# EAGLE schematic power (EAGLE 7.5.0)
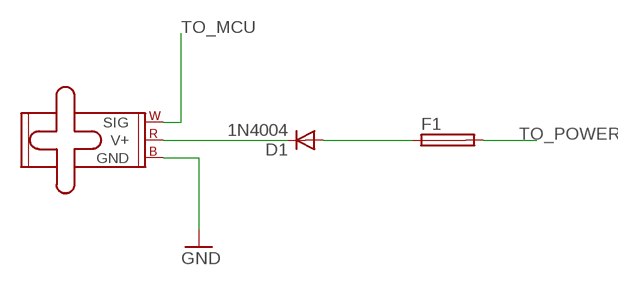
[diagram p0: schematic, sheet 1]

## Parts
D1  1N4004  [DO41-10]
F1  TE5  [TE5]
M1  SMALL_SERVO  [1X03]

## Nets
GND: M1.3(GND)
N$1: D1.C M1.2(V+)
N$2: D1.A F1.1
TO_MCU: M1.1(SIG)
TO_POWER: F1.2

## Library data of the parts
D1 = adafruit:1N4004: DIODE General purpose 1N400x type rectifier (With bigger pads) http://www.ladyada.net/library/pcb/eaglelibrary.html
F1 = fuse:TE5: FUSE Wickmann; OC_FARNELL: unknown; OC_NEWARK: unknown
M1 = SparkFun-Electromechanical:SMALL_SERVO: Small servo motor This is the small servo used in the SIK. SKU: ROB-09065